# Altium schematic sheet supply.SchDoc
size 420 x 297 mm
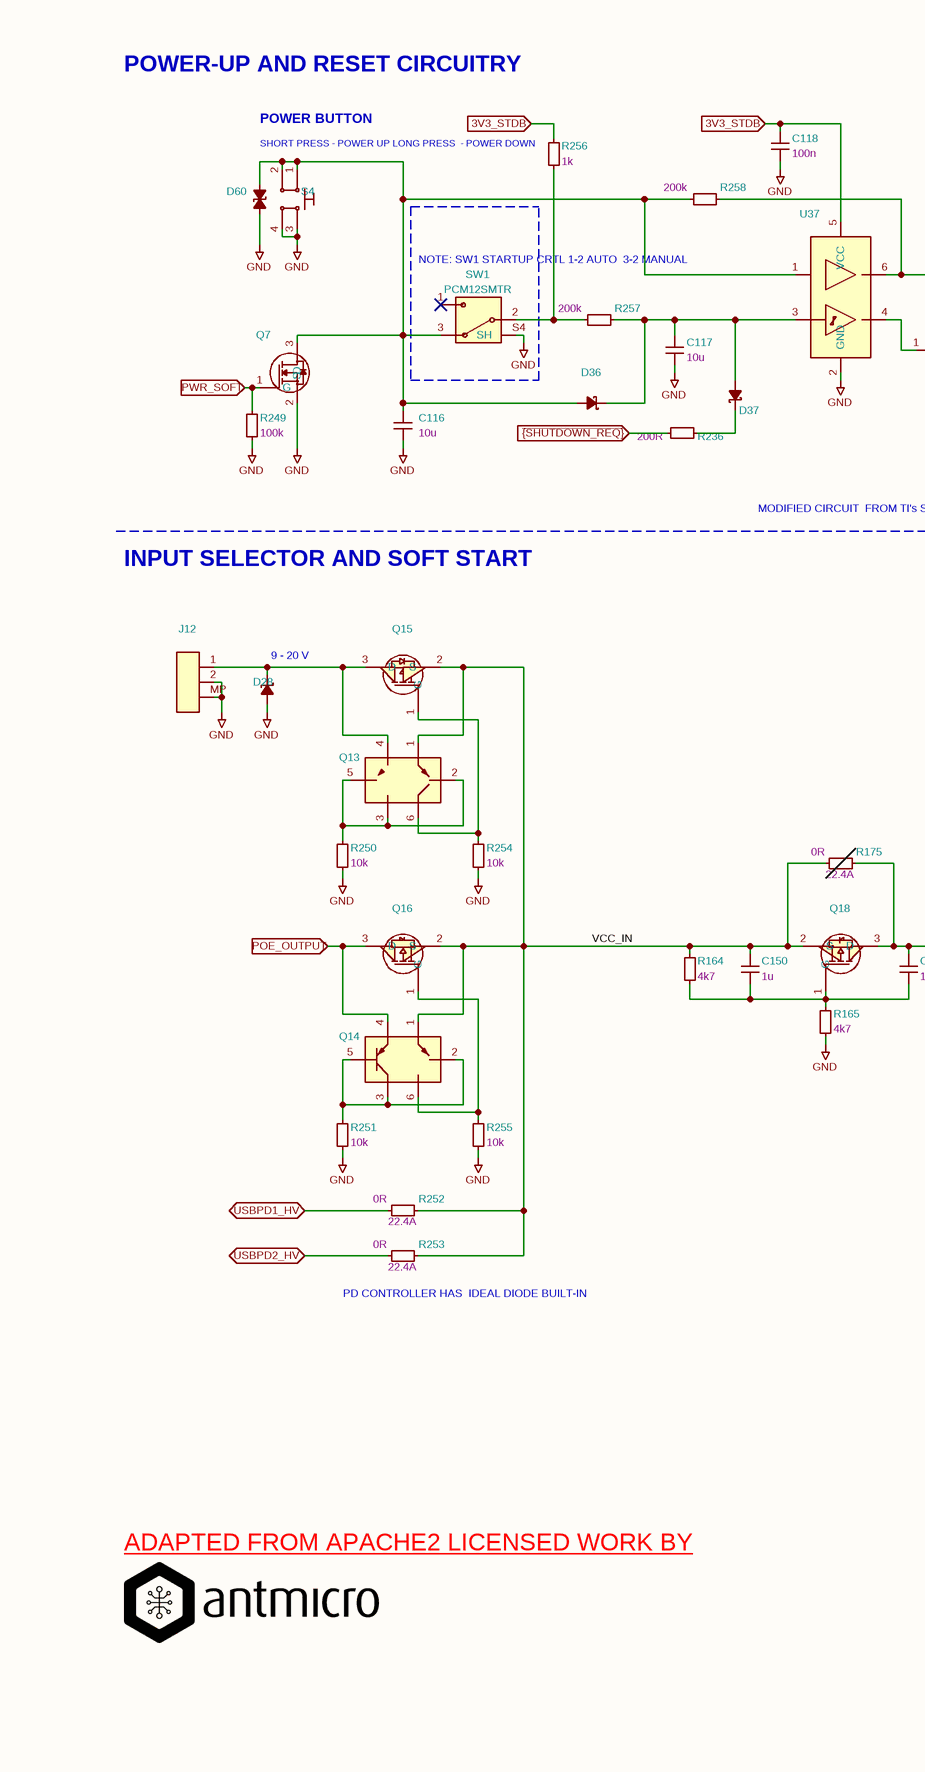
[diagram p0: supply.SchDoc, left]
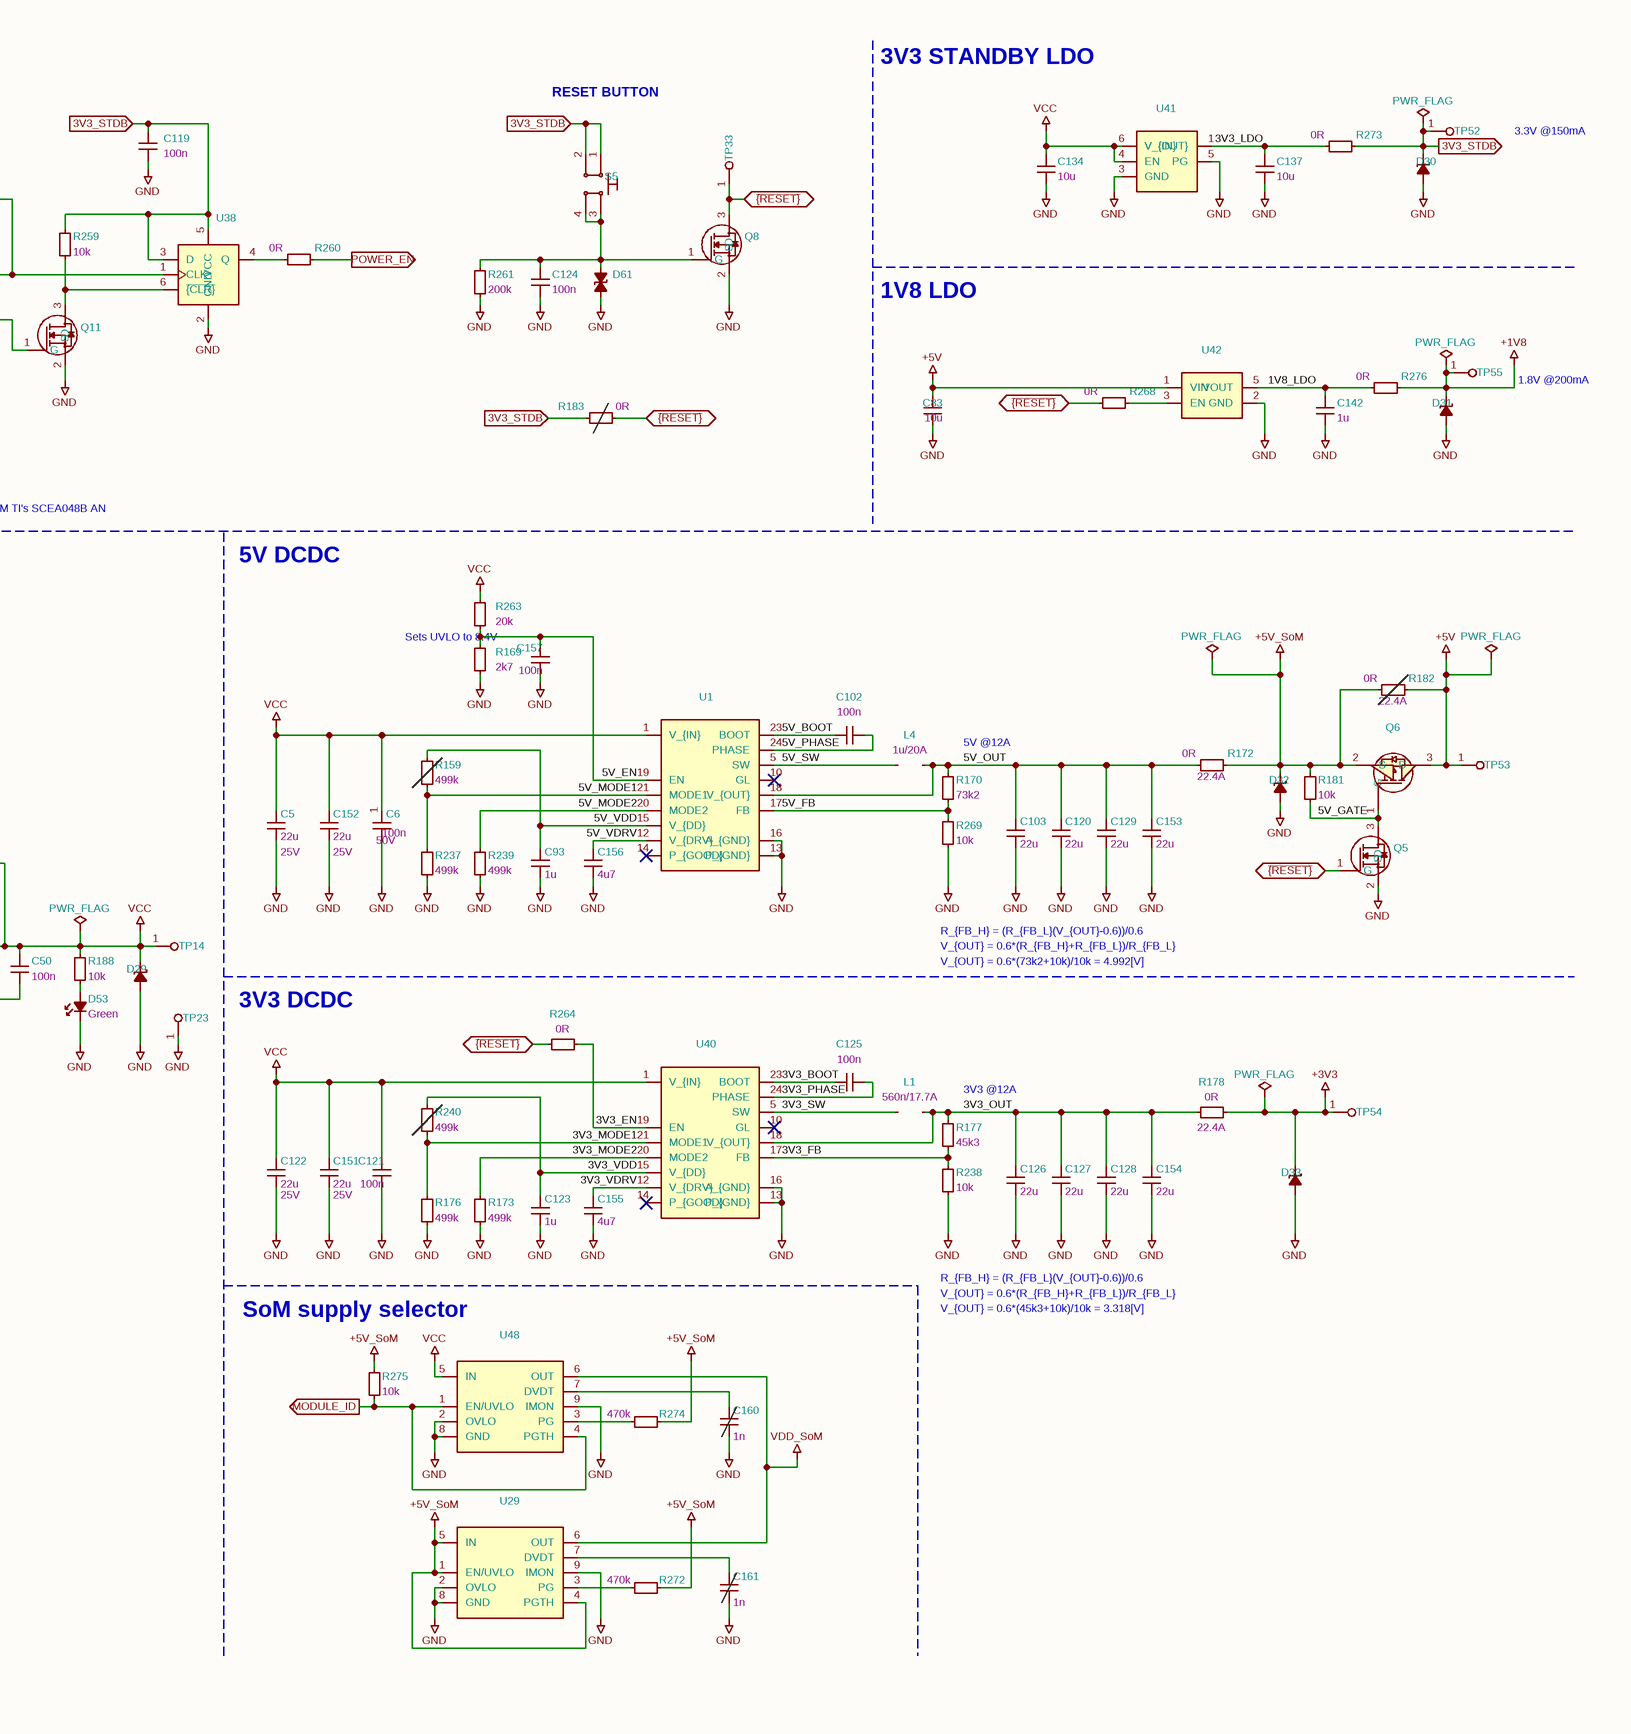
[diagram p1: supply.SchDoc, right]

## Parts
#FLG01  PWR_FLAG  (graphical)
#FLG03  PWR_FLAG  (graphical)
#FLG04  PWR_FLAG  (graphical)
#FLG05  PWR_FLAG  (graphical)
#FLG06  PWR_FLAG  (graphical)
#FLG011  PWR_FLAG  (graphical)
C5  Val: 22u  Voltage: 25V  [C_0805_2012Metric]  (hidden comment: CL21A226MAYNNNE)
C6  Val: 100n  Voltage: 50V  [C_0402_1005Metric]  (hidden comment: GRM155R61H104KE14D)
C50  Val: 100n  [C_0402_1005Metric]  (hidden comment: GRM155R61H104KE14D)
C83  Val: 10u  [C_0402_1005Metric]  (hidden comment: CC0402MRX5R5BB106)
C93  Val: 1u  [C_0402_1005Metric]  (hidden comment: C1005X6S1A105K050BC)
C102  Val: 100n  [C_0402_1005Metric]  (hidden comment: GRM155R61H104KE14D)
C103  Val: 22u  [C_0603_1608Metric_EIA]  (hidden comment: CL10A226MO7JZNC)
C116  Val: 10u  [C_0402_1005Metric]  (hidden comment: CC0402MRX5R5BB106)
C117  Val: 10u  [C_0402_1005Metric]  (hidden comment: CC0402MRX5R5BB106)
C118  Val: 100n  [C_0402_1005Metric]  (hidden comment: GRM155R61H104KE14D)
C119  Val: 100n  [C_0402_1005Metric]  (hidden comment: GRM155R61H104KE14D)
C120  Val: 22u  [C_0603_1608Metric_EIA]  (hidden comment: CL10A226MO7JZNC)
C121  Val: 100n  [C_0402_1005Metric]  (hidden comment: GRM155R61H104KE14D)
C122  Val: 22u  Voltage: 25V  [C_0805_2012Metric]  (hidden comment: CL21A226MAYNNNE)
C123  Val: 1u  [C_0402_1005Metric]  (hidden comment: C1005X6S1A105K050BC)
C124  Val: 100n  [C_0402_1005Metric]  (hidden comment: GRM155R61H104KE14D)
C125  Val: 100n  [C_0402_1005Metric]  (hidden comment: GRM155R61H104KE14D)
C126  Val: 22u  [C_0603_1608Metric_EIA]  (hidden comment: CL10A226MO7JZNC)
C127  Val: 22u  [C_0603_1608Metric_EIA]  (hidden comment: CL10A226MO7JZNC)
C128  Val: 22u  [C_0603_1608Metric_EIA]  (hidden comment: CL10A226MO7JZNC)
C129  Val: 22u  [C_0603_1608Metric_EIA]  (hidden comment: CL10A226MO7JZNC)
C134  Val: 10u  [C_0603_1608Metric]  (hidden comment: C1608X5R1E106M080AC)
C137  Val: 10u  [C_0402_1005Metric]  (hidden comment: CC0402MRX5R5BB106)
C142  Val: 1u  [C_0402_1005Metric]  (hidden comment: C1005X6S1A105K050BC)
C150  Val: 1u  [C_0402_1005Metric]  (hidden comment: GRM155R61E105KE11J)
C151  Val: 22u  Voltage: 25V  [C_0805_2012Metric]  (hidden comment: CL21A226MAYNNNE)
C152  Val: 22u  Voltage: 25V  [C_0805_2012Metric]  (hidden comment: CL21A226MAYNNNE)
C153  Val: 22u  [C_0603_1608Metric_EIA]  (hidden comment: CL10A226MO7JZNC)
C154  Val: 22u  [C_0603_1608Metric_EIA]  (hidden comment: CL10A226MO7JZNC)
C155  Val: 4u7  [C_0402_1005Metric]  (hidden comment: GRM155C61E475ME15J)
C156  Val: 4u7  [C_0402_1005Metric]  (hidden comment: GRM155C61E475ME15J)
C157  Val: 100n  [C_0402_1005Metric]  (hidden comment: GRM155R61H104KE14D)
C160  Val: 1n  [C_0402_1005Metric]  (hidden comment: GRM1555C1H102JA01D)  (no BOM)
C161  Val: 1n  [C_0402_1005Metric]  (hidden comment: GRM1555C1H102JA01D)  (no BOM)
D28  DF2S30FS  [SOD-923]  (value not drawn)
D29  DF2S30FS  [SOD-923]  (value not drawn)
D30  ESD9X5.0ST5G  [SOD-923]  (value not drawn)
D31  ESD9X5.0ST5G  [SOD-923]  (value not drawn)
D32  ESD9X5.0ST5G  [SOD-923]  (value not drawn)
D33  ESD9X5.0ST5G  [SOD-923]  (value not drawn)
D36  RB521S30T1G  [SOD-523]  (value not drawn)
D37  RB521S30T1G  [SOD-523]  (value not drawn)
D53  Color: Green  [LED_0603_1608Metric_G]  (hidden comment: LTST-C190GKT)
D60  TPD1E0B04DPYR  [XDFN-2_1x0.60mm]  (value not drawn)
D61  TPD1E0B04DPYR  [XDFN-2_1x0.60mm]  (value not drawn)
J12  105430-1202  [Conn_Molex_Nano-Fit_1x2_SMD_1054301202]  (value not drawn)
L1  Val: 560n/17.7A  [L_Bourns-SRP5030CA]  (hidden comment: SRP5030CA-R56M)
L4  Val: 1u/20A  [L_Bourns-SRP6050CA]  (hidden comment: SRP6050CA-1R0M)
Q5  PJE138K_R1_00001  [SOT-523]  (value not drawn)
Q6  SSM3J332R,LF  [SOT-23-3]  (value not drawn)
Q7  PJE138K_R1_00001  [SOT-523]  (value not drawn)
Q8  PJE138K_R1_00001  [SOT-523]  (value not drawn)
Q11  PJE138K_R1_00001  [SOT-523]  (value not drawn)
Q13  BCM857BS-7-F  [SOT-363]  (value not drawn)
Q14  BCM857BS-7-F  [SOT-363]  (value not drawn)
Q15  SSM3J332R,LF  [SOT-23-3]  (value not drawn)
Q16  SSM3J332R,LF  [SOT-23-3]  (value not drawn)
Q18  SSM3J332R,LF  [SOT-23-3]  (value not drawn)
R159  Val: 499k  [R_0402_1005Metric]  (hidden comment: CR0402-FX-4993GLF)  (no BOM)
R164  Val: 4k7  [R_0402_1005Metric]  (hidden comment: CR0402-FX-4701GLF)
R165  Val: 4k7  [R_0402_1005Metric]  (hidden comment: CR0402-FX-4701GLF)
R169  Val: 2k7  [R_0402_1005Metric]  (hidden comment: CR0402-FX-2701GLF)
R170  Val: 73k2  [R_0402_1005Metric]  (hidden comment: CR0402-FX-7322GLF)
R172  Val: 0R  Max. Curr.: 22.4A  [R_0603_1608Metric]  (hidden comment: PMR03EZPJ000)
R173  Val: 499k  [R_0402_1005Metric]  (hidden comment: CR0402-FX-4993GLF)
R175  Val: 0R  Max. Curr.: 22.4A  [R_0603_1608Metric]  (hidden comment: PMR03EZPJ000)  (no BOM)
R176  Val: 499k  [R_0402_1005Metric]  (hidden comment: CR0402-FX-4993GLF)
R177  Val: 45k3  [R_0402_1005Metric]  (hidden comment: CR0402-FX-4532GLF)
R178  Val: 0R  Max. Curr.: 22.4A  [R_0603_1608Metric]  (hidden comment: PMR03EZPJ000)
R181  Val: 10k  [R_0402_1005Metric]  (hidden comment: CR0402-FX-1002GLF)
R182  Val: 0R  Max. Curr.: 22.4A  [R_0603_1608Metric]  (hidden comment: PMR03EZPJ000)  (no BOM)
R183  Val: 0R  [R_0402_1005Metric]  (hidden comment: ERJ2GE0R00X)  (no BOM)
R188  Val: 10k  [R_0402_1005Metric]  (hidden comment: CR0402-FX-1002GLF)
R236  Val: 200R  [R_0402_1005Metric]  (hidden comment: CR0402-FX-2000GLF)
R237  Val: 499k  [R_0402_1005Metric]  (hidden comment: CR0402-FX-4993GLF)
R238  Val: 10k  [R_0402_1005Metric]  (hidden comment: CR0402-FX-1002GLF)
R239  Val: 499k  [R_0402_1005Metric]  (hidden comment: CR0402-FX-4993GLF)
R240  Val: 499k  [R_0402_1005Metric]  (hidden comment: CR0402-FX-4993GLF)  (no BOM)
R249  Val: 100k  [R_0402_1005Metric]  (hidden comment: CR0402-FX-1003GLF)
R250  Val: 10k  [R_0402_1005Metric]  (hidden comment: CR0402-FX-1002GLF)
R251  Val: 10k  [R_0402_1005Metric]  (hidden comment: CR0402-FX-1002GLF)
R252  Val: 0R  Max. Curr.: 22.4A  [R_0603_1608Metric]  (hidden comment: PMR03EZPJ000)
R253  Val: 0R  Max. Curr.: 22.4A  [R_0603_1608Metric]  (hidden comment: PMR03EZPJ000)
R254  Val: 10k  [R_0402_1005Metric]  (hidden comment: CR0402-FX-1002GLF)
R255  Val: 10k  [R_0402_1005Metric]  (hidden comment: CR0402-FX-1002GLF)
R256  Val: 1k  [R_0402_1005Metric]  (hidden comment: CR0402-FX-1001GLF)
R257  Val: 200k  [R_0402_1005Metric]  (hidden comment: CR0402-FX-2003GLF)
R258  Val: 200k  [R_0402_1005Metric]  (hidden comment: CR0402-FX-2003GLF)
R259  Val: 10k  [R_0402_1005Metric]  (hidden comment: CR0402-FX-1002GLF)
R260  Val: 0R  [R_0402_1005Metric]  (hidden comment: ERJ2GE0R00X)
R261  Val: 200k  [R_0402_1005Metric]  (hidden comment: CR0402-FX-2003GLF)
R263  Val: 20k  [R_0402_1005Metric]  (hidden comment: CR0402-FX-2002GLF)
R264  Val: 0R  [R_0402_1005Metric]  (hidden comment: ERJ2GE0R00X)
R268  Val: 0R  [R_0402_1005Metric]  (hidden comment: ERJ2GE0R00X)
R269  Val: 10k  [R_0402_1005Metric]  (hidden comment: CR0402-FX-1002GLF)
R272  Val: 470k  [R_0402_1005Metric]  (hidden comment: CR0402-FX-4703GLF)
R273  Val: 0R  [R_0603_1608Metric]  (hidden comment: CR0603-J/-000ELF)
R274  Val: 470k  [R_0402_1005Metric]  (hidden comment: CR0402-FX-4703GLF)
R275  Val: 10k  [R_0402_1005Metric]  (hidden comment: CR0402-FX-1002GLF)
R276  Val: 0R  [R_0603_1608Metric]  (hidden comment: CR0603-J/-000ELF)
S4  KMR211NGLFS  [SW_KMR211NGLFS_SMD]  (value not drawn)
S5  KMR211NGLFS  [SW_KMR211NGLFS_SMD]  (value not drawn)
SW1  PCM12SMTR  [PCM12SMTR]
TP14  TP_0.75mm_SMD  [TP_SMD_0.75mm]  (value not drawn)  (no BOM)
TP23  TP_0.75mm_SMD  [TP_SMD_0.75mm]  (value not drawn)  (no BOM)
TP33  TP_0.75mm_SMD  [TP_SMD_0.75mm]  (value not drawn)  (no BOM)
TP52  TP_0.75mm_SMD  [TP_SMD_0.75mm]  (value not drawn)  (no BOM)
TP53  TP_0.75mm_SMD  [TP_SMD_0.75mm]  (value not drawn)  (no BOM)
TP54  TP_0.75mm_SMD  [TP_SMD_0.75mm]  (value not drawn)  (no BOM)
TP55  TP_0.75mm_SMD  [TP_SMD_0.75mm]  (value not drawn)  (no BOM)
U1  SIC431AED-T1-GE3  [MLP44-24L_4x4x0.75mm]  (value not drawn)
U29  LM73100RPWR  [VQFN-HR-10_2x2mm]  (value not drawn)
U37  74LVC2G14GV,125  [SOT-23-6]  (value not drawn)
U38  74LVC1G175GV,125  [SOT-23-6]  (value not drawn)
U40  SIC431AED-T1-GE3  [MLP44-24L_4x4x0.75mm]  (value not drawn)
U41  NCP730BMT330TBG  [WSON-6-1EP_2x2mm_P0.65mm]  (value not drawn)
U42  TPS7A0518PDBVT  [SOT-23-5]  (value not drawn)
U48  LM73100RPWR  [VQFN-HR-10_2x2mm]  (value not drawn)

## Blocks framed on the sheet
NOTE: / SW1 STARTUP CRTL / 1-2 AUTO / 3-2 MANUAL: SW1

## Ports
3V3_STDB (in), 3V3_STDB (out), MODULE_ID (out), POE_OUTPUT (in), POWER_EN (out), PWR_SOFT (in), USBPD1_HV (bidir), USBPD2_HV (bidir), ~{{RESET}} (bidir), ~{{SHUTDOWN_REQ}} (in)

## Nets
+1V8: #FLG03.1(pwr) D31.1(C) R276.2 TP55.1
+3V3: #FLG06.1(pwr) D33.1(C) R178.2 TP54.1
+5V: #FLG05.1(pwr) C83.1 Q6.3(D) R182.2 TP53.1 U42.1(VIN)
+5V_SoM: #FLG04.1(pwr) D32.1(C) Q6.2(S) R172.2 R181.2 R182.1 R272.1 R274.1 R275.2 U29.1(EN/UVLO) U29.4(PGTH) U29.5(IN)
GND: C5.1 C6.2 C83.2 C93.1 C103.1 C116.1 C117.1 C118.1 C119.1 C120.1 C121.2 C122.1 C123.1 C124.1 C126.1 C127.1 C128.1 C129.1 C134.1 C137.1 C142.1 C151.1 C152.1 C153.1 C154.1 C155.1 C156.1 C157.2 C160.1 C161.1 D28.2(A) D29.2(A) D30.2(A) D31.2(A) D32.2(A) D33.2(A) D53.1(C) D60.1(C) D61.1(C) J12.2 J12.MP Q5.2(S) Q7.2(S) Q8.2(S) Q11.2(S) R165.1 R169.1 R173.1 R176.1 R237.1 R238.1 R239.1 R249.1 R250.1 R251.1 R254.1 R255.1 R261.1 R269.1 S4.3 S4.4 SW1.S4(SH) TP23.1 U1.13(P_{GND}) U1.16(A_{GND}) U29.2(OVLO) U29.8(GND) U29.9(IMON) U37.2(GND) U38.2(GND) U40.13(P_{GND}) U40.16(A_{GND}) U41.3(GND) U41.5(PG) U42.2(GND) U48.2(OVLO) U48.8(GND) U48.9(IMON)
VCC: #FLG011.1(pwr) C5.2 C6.1 C50.2 C121.1 C122.2 C134.2 C151.2 C152.2 D29.1(C) Q18.3(D) R175.2 R188.2 R263.2 TP14.1 U1.1(V_{IN}) U40.1(V_{IN}) U41.4(EN) U41.6(V_{IN}) U48.5(IN)
VDD_SoM: U29.6(OUT) U48.6(OUT)
1V8_LDO: C142.2 R276.1 U42.5(VOUT)
3V3_BOOT: C125.2 U40.23(BOOT)
3V3_EN: R264.2 U40.19(EN)
3V3_FB: R177.1 R238.2 U40.17(FB)
3V3_LDO: C137.2 R273.1 U41.1(V_{OUT})
3V3_MODE1: R176.2 R240.1 U40.21(MODE1)
3V3_MODE2: R173.2 U40.20(MODE2)
3V3_OUT: C126.2 C127.2 C128.2 C154.2 L1.2 R177.2 R178.1 U40.18(V_{OUT})
3V3_PHASE: C125.1 U40.24(PHASE)
3V3_STDB: #FLG01.1(pwr) C118.2 C119.2 D30.1(C) R183.2 R256.2 R259.2 R273.2 S5.1 S5.2 TP52.1 U37.5(VCC) U38.3(D) U38.5(VCC) ; port 3V3_STDB
3V3_SW: L1.1 U40.5(SW)
3V3_VDD: C123.2 R240.2 U40.15(V_{DD})
3V3_VDRV: C155.2 U40.12(V_{DRV})
5V_BOOT: C102.2 U1.23(BOOT)
5V_EN: C157.1 R169.2 R263.1 U1.19(EN)
5V_FB: R170.1 R269.2 U1.17(FB)
5V_GATE: Q5.3(D) Q6.1(G) R181.1
5V_MODE1: R159.1 R237.2 U1.21(MODE1)
5V_MODE2: R239.2 U1.20(MODE2)
5V_OUT: C103.2 C120.2 C129.2 C153.2 L4.2 R170.2 R172.1 U1.18(V_{OUT})
5V_PHASE: C102.1 U1.24(PHASE)
5V_SW: L4.1 U1.5(SW)
5V_VDD: C93.2 R159.2 U1.15(V_{DD})
5V_VDRV: C156.2 U1.12(V_{DRV})
MODULE_ID: R275.1 U48.1(EN/UVLO) U48.4(PGTH) ; port MODULE_ID
POE_OUTPUT: Q14.4 Q16.3(D) ; port POE_OUTPUT
POWER_EN: R260.2 ; port POWER_EN
PWR_SOFT: Q7.1(G) R249.2 ; port PWR_SOFT
USBPD1_HV: R252.1 ; port USBPD1_HV
USBPD2_HV: R253.1 ; port USBPD2_HV
VCC_IN: C150.2 Q13.1 Q14.1 Q15.2(S) Q16.2(S) Q18.2(S) R164.2 R175.1 R252.2 R253.2
~{{RESET}}: Q5.1(G) Q8.3(D) R183.1 R264.1 R268.1 TP33.1 ; port ~{{RESET}}
~{{SHUTDOWN_REQ}}: R236.2 ; port ~{{SHUTDOWN_REQ}}
NetC50_1: C50.1 C150.1 Q18.1(G) R164.1 R165.2
NetC116_2: C116.2 D36.2(A) D60.2(A) Q7.3(D) R258.1 S4.1 S4.2 SW1.3 U37.1
NetC117_2: C117.2 D36.1(C) D37.2(A) R257.2 U37.3
NetC124_2: C124.2 D61.2(A) Q8.1(G) R261.2 S5.3 S5.4
NetC160_2: C160.2 U48.7(DVDT)
NetC161_2: C161.2 U29.7(DVDT)
NetD28_1: D28.1(C) J12.1 Q13.4 Q15.3(D)
NetD37_1: D37.1(C) R236.1
NetD53_2: D53.2(A) R188.1
NetQ11_1: Q11.1(G) U37.4
NetQ11_3: Q11.3(D) R259.1 U38.6(~{{CLR}})
NetQ13_2: Q13.2 Q13.3 Q13.5 R250.2
NetQ13_6: Q13.6 Q15.1(G) R254.2
NetQ14_2: Q14.2 Q14.3 Q14.5 R251.2
NetQ14_6: Q14.6 Q16.1(G) R255.2
NetR256_1: R256.1 R257.1 SW1.2
NetR258_2: R258.2 U37.6 U38.1(CLK)
NetR260_1: R260.1 U38.4(Q)
NetR268_2: R268.2 U42.3(EN)
NetR272_2: R272.2 U29.3(PG)
NetR274_2: R274.2 U48.3(PG)

Not connected (* = marked no-connect by the designer): SW1 1* S1(SH) S2(SH) S3(SH); U1 2(V_{IN}) 3(P_{GND}) 4(P_{GND}) 6(SW) 7(SW) 8(SW) 9(SW) 10(GL)* 11(GL) 14(P_{GOOD})* 22(V_{IN}) 25(A_{GND}) 26(V_{IN}) 27(P_{GND}) 28(GL); U29 10(DNC); U40 2(V_{IN}) 3(P_{GND}) 4(P_{GND}) 6(SW) 7(SW) 8(SW) 9(SW) 10(GL)* 11(GL) 14(P_{GOOD})* 22(V_{IN}) 25(A_{GND}) 26(V_{IN}) 27(P_{GND}) 28(GL); U41 2(NC) 7(GND); U42 4(NC); U48 10(DNC)

## Notes on the sheet
- POWER-UP AND RESET CIRCUITRY
- RESET BUTTON
- 3V3 STANDBY LDO
- SHORT PRESS - POWER UP
  LONG PRESS  - POWER DOWN
- POWER BUTTON
- 3.3V
  @150mA
- 1V8 LDO
- 1.8V
  @200mA
- MODIFIED CIRCUIT
  FROM TI's SCEA048B AN
- INPUT SELECTOR AND SOFT START
- 5V DCDC
- (near D28) 9 - 20 V
- Sets UVLO to 8.4V
- 5V @12A
- 3V3 DCDC
- V_{OUT} = 0.6*(R_{FB_H}+R_{FB_L})/R_{FB_L}
- V_{OUT} = 0.6*(73k2+10k)/10k = 4.992[V]
- R_{FB_H} = (R_{FB_L}(V_{OUT}-0.6))/0.6
- 3V3 @12A
- (near R253) PD CONTROLLER HAS
  IDEAL DIODE BUILT-IN
- V_{OUT} = 0.6*(45k3+10k)/10k = 3.318[V]
- SoM supply selector
- ADAPTED FROM APACHE2 LICENSED WORK BY <https://github.com/antmicro/jetson-orin-baseboard>
- 1
- 2
- 3
- 4
- 5
- 6
- 7
- 8
- A
- B
- C
- D
- E
- www.antmicro.com <http://www.antmicro.com>
- Title: Jetson Orin Baseboard
- File: supply.kicad_sch
- Sheet: /
- Antmicro Ltd
- F
- KiCad E.D.A.  kicad (5.1.4)-1
- Size: A3
- Date: 2025-01-15
- Rev: 1.3.0
- Id: 1/1

## Library data of the parts
C5 C122 C151 C152 = C_22u_25V_0805: Manufacturer 1: Samsung Electro-Mechanics; License: Apache-2.0; Dielectric: X5R; Public: False; Author: Antmicro; OldValue: C_22u_25V_0805; Manufacturer Part Number 1: CL21A226MAYNNNE; Value: CL21A226MAYNNNE; Footprint: antmicro-footprints:C_0805_2012Metric
C6 = C_100n_0402: Manufacturer 1: Murata; License: Apache-2.0; Dielectric: X5R; Author: Antmicro; OldValue: C_100n_0402; Manufacturer Part Number 1: GRM155R61H104KE14D; Value: GRM155R61H104KE14D; Footprint: antmicro-footprints:C_0402_1005Metric
C50 C102 C118 C119 C121 C124 C125 C157 = C_100n_0402: Manufacturer 1: Murata; License: Apache-2.0; Voltage: 50V; Dielectric: X5R; Author: Antmicro; OldValue: C_100n_0402; Manufacturer Part Number 1: GRM155R61H104KE14D; Value: GRM155R61H104KE14D; Footprint: antmicro-footprints:C_0402_1005Metric
C83 C116 C117 C137 = C_10u_0402: Manufacturer 1: YAGEO; License: Apache-2.0; Author: Antmicro; OldValue: C_10u_0402; Manufacturer Part Number 1: CC0402MRX5R5BB106; Value: CC0402MRX5R5BB106; Footprint: antmicro-footprints:C_0402_1005Metric
C93 C123 C142 = C_1u_0402: Manufacturer 1: TDK; License: Apache-2.0; Author: Antmicro; OldValue: C_1u_0402; Manufacturer Part Number 1: C1005X6S1A105K050BC; Value: C1005X6S1A105K050BC; Footprint: antmicro-footprints:C_0402_1005Metric
C103 C120 C126-C129 C153 C154 = C_22u_16V_0603: Manufacturer 1: Samsung Electro-Mechanics; License: Apache-2.0; Voltage: 16V; Author: Antmicro; OldValue: C_22u_16V_0603; Manufacturer Part Number 1: CL10A226MO7JZNC; Value: CL10A226MO7JZNC; Footprint: antmicro-footprints:C_0603_1608Metric_EIA
C134 = C_10u_25V_0603: Manufacturer 1: TDK; License: Apache-2.0; Voltage: 25V; Author: Antmicro; OldValue: C_10u_25V_0603; Manufacturer Part Number 1: C1608X5R1E106M080AC; Value: C1608X5R1E106M080AC; Footprint: antmicro-footprints:C_0603_1608Metric
C150 = C_1u_25V_0402: Manufacturer 1: Murata; License: Apache-2.0; Voltage: 25V; Dielectric: X5R; Author: Antmicro; OldValue: C_1u_25V_0402; Manufacturer Part Number 1: GRM155R61E105KE11J; Value: GRM155R61E105KE11J; Footprint: antmicro-footprints:C_0402_1005Metric
C155 C156 = C_4u7_25V_0402: Manufacturer 1: Murata; License: Apache-2.0; Voltage: 25V; Dielectric: X5S; Author: Antmicro; OldValue: C_4u7_25V_0402; Manufacturer Part Number 1: GRM155C61E475ME15J; Value: GRM155C61E475ME15J; Footprint: antmicro-footprints:C_0402_1005Metric
C160 C161 = C_1n_0402: Manufacturer 1: Murata; License: Apache-2.0; Voltage: 50V; Dielectric: C0G; Author: Antmicro; OldValue: C_1n_0402; Manufacturer Part Number 1: GRM1555C1H102JA01D; Value: GRM1555C1H102JA01D; Footprint: antmicro-footprints:C_0402_1005Metric
D28 D29 = DF2S30FS_SOD: Manufacturer 1: Toshiba; License: Apache-2.0; Author: Antmicro; OldValue: DF2S30FS_SOD; Manufacturer Part Number 1: DF2S30FS; Value: DF2S30FS; Footprint: antmicro-footprints:SOD-923
D30-D33 = ESD9X5.0ST5G: Manufacturer 1: ON Semiconductor; License: Apache-2.0; Author: Antmicro; OldValue: ESD9X5.0ST5G; Manufacturer Part Number 1: ESD9X5.0ST5G; Value: ESD9X5.0ST5G; Footprint: antmicro-footprints:SOD-923
D36 D37 = RB521S30T1G: Manufacturer 1: ON Semiconductor; License: Apache-2.0; Author: Antmicro; OldValue: RB521S30T1G; Manufacturer Part Number 1: RB521S30T1G; Value: RB521S30T1G; Footprint: antmicro-footprints:SOD-523
D53 = LED_G_0603_LTST-C190GKT: Manufacturer 1: Lite-On; License: Apache-2.0; Author: Antmicro; OldValue: LED_G_0603_LTST-C190GKT; Manufacturer Part Number 1: LTST-C190GKT; Value: LTST-C190GKT; Footprint: antmicro-footprints:LED_0603_1608Metric_G
D60 D61 = TPD1E0B04_XDFN-2: Manufacturer 1: Texas Instruments; License: Apache-2.0; Author: Antmicro; OldValue: TPD1E0B04_XDFN-2; Manufacturer Part Number 1: TPD1E0B04DPYR; Value: TPD1E0B04DPYR; Footprint: antmicro-footprints:XDFN-2_1x0.60mm
J12 = Molex_Nano-Fit_1x2_SMD_1054301202: Manufacturer 1: Molex; License: Apache-2.0; Author: Antmicro; OldValue: Molex_Nano-Fit_1x2_SMD_1054301202; Manufacturer Part Number 1: 105430-1202; Value: 105430-1202; Footprint: antmicro-footprints:Conn_Molex_Nano-Fit_1x2_SMD_1054301202
L1 = L_560n_17.7A_Bourns-SRP5030CA: Manufacturer 1: Bourns; ISat: 22.2 A; IMax: 17.7 A; License: Apache-2.0; Size: 5.5x5.3; Author: Antmicro; OldValue: L_560n_17.7A_Bourns-SRP5030CA; Manufacturer Part Number 1: SRP5030CA-R56M; Value: SRP5030CA-R56M; Footprint: antmicro-footprints:L_Bourns-SRP5030CA
L4 = L_1u_20A_Bourns-SRP6050CA: Manufacturer 1: Bourns; ISat: 23 A; IMax: 20 A; License: Apache-2.0; Size: 6.6x6.4; Author: Antmicro; OldValue: L_1u_20A_Bourns-SRP6050CA; Manufacturer Part Number 1: SRP6050CA-1R0M; Value: SRP6050CA-1R0M; Footprint: antmicro-footprints:L_Bourns-SRP6050CA
Q5 Q7 Q8 Q11 = PJE138K: Manufacturer 1: PANJIT; License: Apache-2.0; Author: Antmicro; OldValue: PJE138K; Manufacturer Part Number 1: PJE138K_R1_00001; Value: PJE138K_R1_00001; Footprint: antmicro-footprints:SOT-523
Q6 Q15 Q16 Q18 = SSM3J332R: Manufacturer 1: Toshiba; License: Apache-2.0; Author: Antmicro; OldValue: SSM3J332R; Manufacturer Part Number 1: SSM3J332R,LF; Value: SSM3J332R,LF; Footprint: antmicro-footprints:SOT-23-3
Q13 Q14 = BCM857BS-7-F: Manufacturer 1: Diodes Incorporated; License: Apache-2.0; Author: Antmicro; OldValue: BCM857BS-7-F; Manufacturer Part Number 1: BCM857BS-7-F; Value: BCM857BS-7-F; Footprint: antmicro-footprints:SOT-363
R159 R173 R176 R237 R239 R240 = R_499k_0402: Manufacturer 1: Bourns; License: Apache-2.0; Tolerance: 1%; Author: Antmicro; OldValue: R_499k_0402; Manufacturer Part Number 1: CR0402-FX-4993GLF; Value: CR0402-FX-4993GLF; Footprint: antmicro-footprints:R_0402_1005Metric
R164 R165 = R_4k7_0402: Manufacturer 1: Bourns; License: Apache-2.0; Tolerance: 1%; Author: Antmicro; OldValue: R_4k7_0402; Manufacturer Part Number 1: CR0402-FX-4701GLF; Value: CR0402-FX-4701GLF; Footprint: antmicro-footprints:R_0402_1005Metric
R169 = R_2k7_0402: Manufacturer 1: Bourns; License: Apache-2.0; Tolerance: 1%; Author: Antmicro; OldValue: R_2k7_0402; Manufacturer Part Number 1: CR0402-FX-2701GLF; Value: CR0402-FX-2701GLF; Footprint: antmicro-footprints:R_0402_1005Metric
R170 = R_73k2_0402: Manufacturer 1: Bourns; License: Apache-2.0; Tolerance: 1%; Author: Antmicro; OldValue: R_73k2_0402; Manufacturer Part Number 1: CR0402-FX-7322GLF; Value: CR0402-FX-7322GLF; Footprint: antmicro-footprints:R_0402_1005Metric
R172 R175 R178 R182 R252 R253 = R_0R_22.4A_0603: Manufacturer 1: ROHM Semiconductor; License: Apache-2.0; Tolerance: template_tolerance; Author: Antmicro; OldValue: R_0R_22.4A_0603; Manufacturer Part Number 1: PMR03EZPJ000; Value: PMR03EZPJ000; Footprint: antmicro-footprints:R_0603_1608Metric
R177 = R_45k3_0402: Manufacturer 1: Bourns; License: Apache-2.0; Tolerance: 1%; Author: Antmicro; OldValue: R_45k3_0402; Manufacturer Part Number 1: CR0402-FX-4532GLF; Value: CR0402-FX-4532GLF; Footprint: antmicro-footprints:R_0402_1005Metric
R181 R188 R238 R250 R251 R254 R255 R259 R269 R275 = R_10k_0402: Manufacturer 1: Bourns; License: Apache-2.0; Tolerance: 1%; Author: Antmicro; OldValue: R_10k_0402; Manufacturer Part Number 1: CR0402-FX-1002GLF; Value: CR0402-FX-1002GLF; Footprint: antmicro-footprints:R_0402_1005Metric
R183 R260 R264 R268 = R_0R_0402: Manufacturer 1: Panasonic; License: Apache-2.0; Tolerance: ~; Current: 1A; Author: Antmicro; OldValue: R_0R_0402; Manufacturer Part Number 1: ERJ2GE0R00X; Value: ERJ2GE0R00X; Footprint: antmicro-footprints:R_0402_1005Metric
R236 = R_200R_0402: Manufacturer 1: Bourns; License: Apache-2.0; Tolerance: 1%; Author: Antmicro; OldValue: R_200R_0402; Manufacturer Part Number 1: CR0402-FX-2000GLF; Value: CR0402-FX-2000GLF; Footprint: antmicro-footprints:R_0402_1005Metric
R249 = R_100k_0402: Manufacturer 1: Bourns; License: Apache-2.0; Tolerance: 1%; Author: Antmicro; OldValue: R_100k_0402; Manufacturer Part Number 1: CR0402-FX-1003GLF; Value: CR0402-FX-1003GLF; Footprint: antmicro-footprints:R_0402_1005Metric
R256 = R_1k_0402: Manufacturer 1: Bourns; License: Apache-2.0; Tolerance: 1%; Author: Antmicro; OldValue: R_1k_0402; Manufacturer Part Number 1: CR0402-FX-1001GLF; Value: CR0402-FX-1001GLF; Footprint: antmicro-footprints:R_0402_1005Metric
R257 R258 R261 = R_200k_0402: Manufacturer 1: Bourns; License: Apache-2.0; Tolerance: 1%; Author: Antmicro; OldValue: R_200k_0402; Manufacturer Part Number 1: CR0402-FX-2003GLF; Value: CR0402-FX-2003GLF; Footprint: antmicro-footprints:R_0402_1005Metric
R263 = R_20k_0402: Manufacturer 1: Bourns; License: Apache-2.0; Tolerance: 1%; Author: Antmicro; OldValue: R_20k_0402; Manufacturer Part Number 1: CR0402-FX-2002GLF; Value: CR0402-FX-2002GLF; Footprint: antmicro-footprints:R_0402_1005Metric
R272 R274 = R_470k_0402: Manufacturer 1: Bourns; License: Apache-2.0; Tolerance: 1%; Author: Antmicro; OldValue: R_470k_0402; Manufacturer Part Number 1: CR0402-FX-4703GLF; Value: CR0402-FX-4703GLF; Footprint: antmicro-footprints:R_0402_1005Metric
R273 R276 = R_0R_0603: Manufacturer 1: Bourns; License: Apache-2.0; Tolerance: ~; Current: 1A; Author: Antmicro; OldValue: R_0R_0603; Manufacturer Part Number 1: CR0603-J/-000ELF; Value: CR0603-J/-000ELF; Footprint: antmicro-footprints:R_0603_1608Metric
S4 S5 = SW_KMR211NGLFS_SMD: Manufacturer 1: C&K; License: Apache-2.0; Author: Antmicro; OldValue: SW_KMR211NGLFS_SMD; Manufacturer Part Number 1: KMR211NGLFS; Value: KMR211NGLFS; Footprint: antmicro-footprints:SW_KMR211NGLFS_SMD
SW1 = SW_SPDT_PCM12SMTR: Manufacturer 1: C&K; License: Apache-2.0; Author: Antmicro; OldValue: SW_SPDT_PCM12SMTR; Manufacturer Part Number 1: PCM12SMTR; Value: PCM12SMTR; Footprint: antmicro-footprints:PCM12SMTR
TP14 TP23 TP52-TP55 = TP_0.75mm_SMD: License: Apache-2.0; Author: Antmicro; OldValue: TP_0.75mm_SMD; Value: TP_0.75mm_SMD; Footprint: antmicro-footprints:TP_SMD_0.75mm
TP33 = TP_0.75mm_SMD_3: License: Apache-2.0; Author: Antmicro; OldValue: TP_0.75mm_SMD; Value: TP_0.75mm_SMD; Footprint: antmicro-footprints:TP_SMD_0.75mm
U1 = SIC431AED-T1-GE3_1: Manufacturer 1: Vishay; License: Apache-2.0; Author: Antmicro; OldValue: SIC431AED-T1-GE3; Manufacturer Part Number 1: SIC431AED-T1-GE3; Value: SIC431AED-T1-GE3; Footprint: antmicro-footprints:MLP44-24L_4x4x0.75mm
U29 U48 = LM73100: Manufacturer 1: Texas Instruments; License: Apache-2.0; Author: Antmicro; OldValue: LM73100; Manufacturer Part Number 1: LM73100RPWR; Value: LM73100RPWR; Footprint: antmicro-footprints:VQFN-HR-10_2x2mm
U37 = 74LVC2G14_SOT457: Manufacturer 1: Nexperia; License: Apache-2.0; Author: Antmicro; OldValue: 74LVC2G14_SOT457; Manufacturer Part Number 1: 74LVC2G14GV,125; Value: 74LVC2G14GV,125; Footprint: antmicro-footprints:SOT-23-6
U38 = 74LVC1G175_SOT457: Manufacturer 1: Nexperia; License: Apache-2.0; Author: Antmicro; OldValue: 74LVC1G175_SOT457; Manufacturer Part Number 1: 74LVC1G175GV,125; Value: 74LVC1G175GV,125; Footprint: antmicro-footprints:SOT-23-6
U40 = SIC431AED-T1-GE3: Manufacturer 1: Vishay; License: Apache-2.0; Author: Antmicro; OldValue: SIC431AED-T1-GE3; Manufacturer Part Number 1: SIC431AED-T1-GE3; Value: SIC431AED-T1-GE3; Footprint: antmicro-footprints:MLP44-24L_4x4x0.75mm
U41 = NCP730BMT330_WSON: Manufacturer 1: ON Semiconductor; License: Apache-2.0; Author: Antmicro; OldValue: NCP730BMT330_WSON; Manufacturer Part Number 1: NCP730BMT330TBG; Value: NCP730BMT330TBG; Footprint: antmicro-footprints:WSON-6-1EP_2x2mm_P0.65mm
U42 = TPS7A0518P_SOT23-5: Manufacturer 1: Texas Instruments; License: Apache-2.0; Author: Antmicro; OldValue: TPS7A0518P_SOT23-5; Manufacturer Part Number 1: TPS7A0518PDBVT; Value: TPS7A0518PDBVT; Footprint: antmicro-footprints:SOT-23-5
#FLG01 #FLG03 #FLG04 #FLG05 #FLG06 #FLG011 = PWR_FLAG: Value: PWR_FLAG